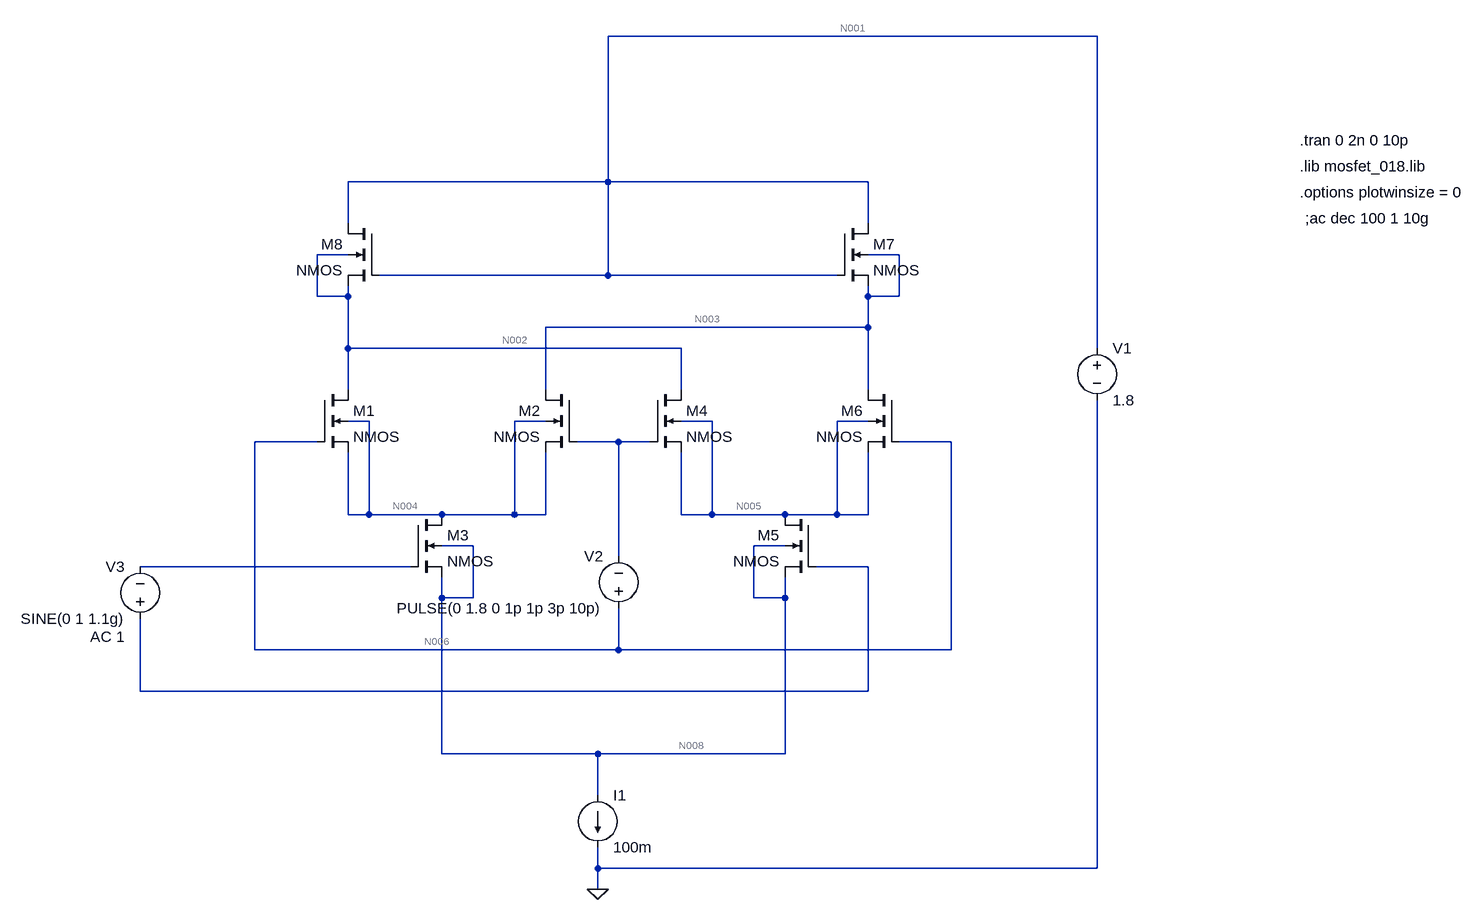
[diagram p0: schematic gilbert_cell_pl.asc]
gilbert_cell_pl.asc, the LTspice schematic file:
Version 4
SHEET 1 1732 680
WIRE 1136 -720 384 -720
WIRE 384 -496 384 -720
WIRE 384 -496 -16 -496
WIRE 784 -496 384 -496
WIRE -16 -432 -16 -496
WIRE 784 -432 784 -496
WIRE -16 -384 -64 -384
WIRE 832 -384 784 -384
WIRE 384 -352 384 -496
WIRE 384 -352 32 -352
WIRE 736 -352 384 -352
WIRE -64 -320 -64 -384
WIRE -16 -320 -16 -336
WIRE -16 -320 -64 -320
WIRE 784 -320 784 -336
WIRE 832 -320 832 -384
WIRE 832 -320 784 -320
WIRE 784 -272 784 -320
WIRE 784 -272 288 -272
WIRE -16 -240 -16 -320
WIRE 496 -240 -16 -240
WIRE 1136 -240 1136 -720
WIRE -16 -176 -16 -240
WIRE 288 -176 288 -272
WIRE 496 -176 496 -240
WIRE 784 -176 784 -272
WIRE 16 -128 -16 -128
WIRE 288 -128 240 -128
WIRE 544 -128 496 -128
WIRE 784 -128 736 -128
WIRE -64 -96 -160 -96
WIRE 400 -96 336 -96
WIRE 448 -96 400 -96
WIRE 912 -96 832 -96
WIRE -16 16 -16 -80
WIRE 16 16 16 -128
WIRE 16 16 -16 16
WIRE 128 16 16 16
WIRE 240 16 240 -128
WIRE 240 16 128 16
WIRE 288 16 288 -80
WIRE 288 16 240 16
WIRE 496 16 496 -80
WIRE 544 16 544 -128
WIRE 544 16 496 16
WIRE 656 16 544 16
WIRE 736 16 736 -128
WIRE 736 16 656 16
WIRE 784 16 784 -80
WIRE 784 16 736 16
WIRE 176 64 128 64
WIRE 656 64 608 64
WIRE 400 80 400 -96
WIRE 80 96 -336 96
WIRE 784 96 704 96
WIRE 128 144 128 112
WIRE 176 144 176 64
WIRE 176 144 128 144
WIRE 608 144 608 64
WIRE 656 144 656 112
WIRE 656 144 608 144
WIRE -160 224 -160 -96
WIRE 400 224 400 160
WIRE 400 224 -160 224
WIRE 912 224 912 -96
WIRE 912 224 400 224
WIRE -336 288 -336 176
WIRE 784 288 784 96
WIRE 784 288 -336 288
WIRE 128 384 128 144
WIRE 368 384 128 384
WIRE 656 384 656 144
WIRE 656 384 368 384
WIRE 368 448 368 384
WIRE 368 560 368 528
WIRE 1136 560 1136 -160
WIRE 1136 560 368 560
WIRE 368 592 368 560
FLAG 368 592 0
SYMBOL nmos4 -64 -176 R0
SYMATTR InstName M1
SYMATTR Value2 l=0.18u w=6u
SYMBOL nmos4 336 -176 M0
SYMATTR InstName M2
SYMATTR Value2 l=0.18u w=6u
SYMBOL nmos4 80 16 R0
SYMATTR InstName M3
SYMATTR Value2 l=0.18u w=6u
SYMBOL nmos4 448 -176 R0
SYMATTR InstName M4
SYMATTR Value2 l=0.18u w=6u
SYMBOL nmos4 704 16 M0
SYMATTR InstName M5
SYMATTR Value2 l=0.18u w=6u
SYMBOL nmos4 832 -176 M0
SYMATTR InstName M6
SYMATTR Value2 l=0.18u w=6u
SYMBOL voltage 1136 -256 R0
WINDOW 123 0 0 Left 0
WINDOW 39 0 0 Left 0
SYMATTR InstName V1
SYMATTR Value 1.8
SYMBOL voltage 400 176 R180
WINDOW 0 24 96 Left 2
WINDOW 3 24 16 Left 2
WINDOW 123 0 0 Left 0
WINDOW 39 0 0 Left 0
SYMATTR InstName V2
SYMATTR Value PULSE(0 1.8 0 1p 1p 3p 10p)
SYMBOL current 368 448 R0
WINDOW 123 0 0 Left 0
WINDOW 39 0 0 Left 0
SYMATTR InstName I1
SYMATTR Value 100m
SYMBOL voltage -336 192 R180
WINDOW 0 24 96 Left 2
WINDOW 3 24 16 Left 2
WINDOW 123 24 -12 Left 2
WINDOW 39 0 0 Left 0
SYMATTR InstName V3
SYMATTR Value SINE(0 1 1.1g)
SYMATTR Value2 AC 1
SYMBOL nmos4 736 -432 R0
SYMATTR InstName M7
SYMATTR Value2 l=0.18u w=6u
SYMBOL nmos4 32 -432 M0
SYMATTR InstName M8
SYMATTR Value2 l=0.18u w=6u
TEXT 1448 -560 Left 2 !.tran 0 2n 0 10p
TEXT 1448 -520 Left 2 !.lib mosfet_018.lib
TEXT 1448 -480 Left 2 !.options plotwinsize = 0
TEXT 1456 -440 Left 2 !;ac dec 100 1 10g

The netlist it stands for:
* gilbert_cell_pl.asc
M1 N002 N006 N004 N004 NMOS l=0.18u w=6u
M2 N003 N007 N004 N004 NMOS l=0.18u w=6u
M3 N004 N009 N008 N008 NMOS l=0.18u w=6u
M4 N002 N007 N005 N005 NMOS l=0.18u w=6u
M5 N005 N010 N008 N008 NMOS l=0.18u w=6u
M6 N003 N006 N005 N005 NMOS l=0.18u w=6u
V1 N001 0 1.8
V2 N006 N007 PULSE(0 1.8 0 1p 1p 3p 10p)
I1 N008 0 100m
V3 N010 N009 SINE(0 1 1.1g) AC 1
M7 N001 N001 N003 N003 NMOS l=0.18u w=6u
M8 N001 N001 N002 N002 NMOS l=0.18u w=6u
.model NMOS NMOS
.model PMOS PMOS
.lib standard.mos
.tran 0 2n 0 10p
.lib mosfet_018.lib
.options plotwinsize = 0
;ac dec 100 1 10g
.backanno
.end

* Results of the author's LTspice run, read from the files saved beside the schematic
* Operating Point, zero values left out:
*   V(n002) = -10.45 V
*   V(n004) = -13.57 V
*   V(n003) = -10.45 V
*   V(n008) = -18.28 V
*   V(n005) = -13.57 V
*   V(n001) = 1.8 V
*   Id(M1) = 25 mA
*   Ib(M1) = -3.133 pA
*   Is(M1) = -25 mA
*   Id(M2) = 25 mA
*   Ib(M2) = -3.133 pA
*   Is(M2) = -25 mA
*   Id(M3) = 50 mA
*   Ib(M3) = -4.72 pA
*   Is(M3) = -50 mA
*   Id(M4) = 25 mA
*   Ib(M4) = -3.133 pA
*   Is(M4) = -25 mA
*   Id(M5) = 50 mA
*   Ib(M5) = -4.72 pA
*   Is(M5) = -50 mA
*   Id(M6) = 25 mA
*   Ib(M6) = -3.133 pA
*   Is(M6) = -25 mA
*   Id(M7) = 50 mA
*   Ib(M7) = -12.26 pA
*   Is(M7) = -50 mA
*   Id(M8) = 50 mA
*   Ib(M8) = -12.26 pA
*   Is(M8) = -50 mA
*   I(I1) = 100 mA
*   I(V1) = -100 mA
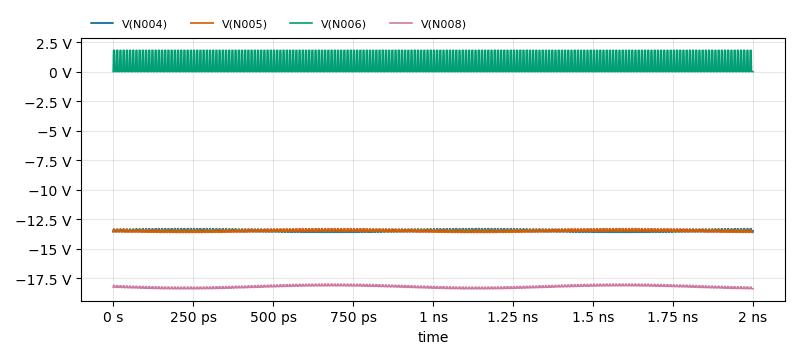
[diagram p1: Transient Analysis of gilbert_cell_pl.asc, plotted from the saved traces]
* Transient Analysis, 1 run:
*   V(N004): min -13.63 V, max -13.32 V, average -13.49 V, rms 13.49 V, last -13.51 V
*   V(N005): min -13.63 V, max -13.32 V, average -13.5 V, rms 13.5 V, last -13.63 V
*   V(N006): min 0 V, max 1.8 V, average 720 mV, rms 1.094 V, last 0 V
*   V(N008): min -18.41 V, max -18.01 V, average -18.23 V, rms 18.23 V, last -18.41 V